# Altium schematic sheet 23.SchDoc
size 297 x 209 mm
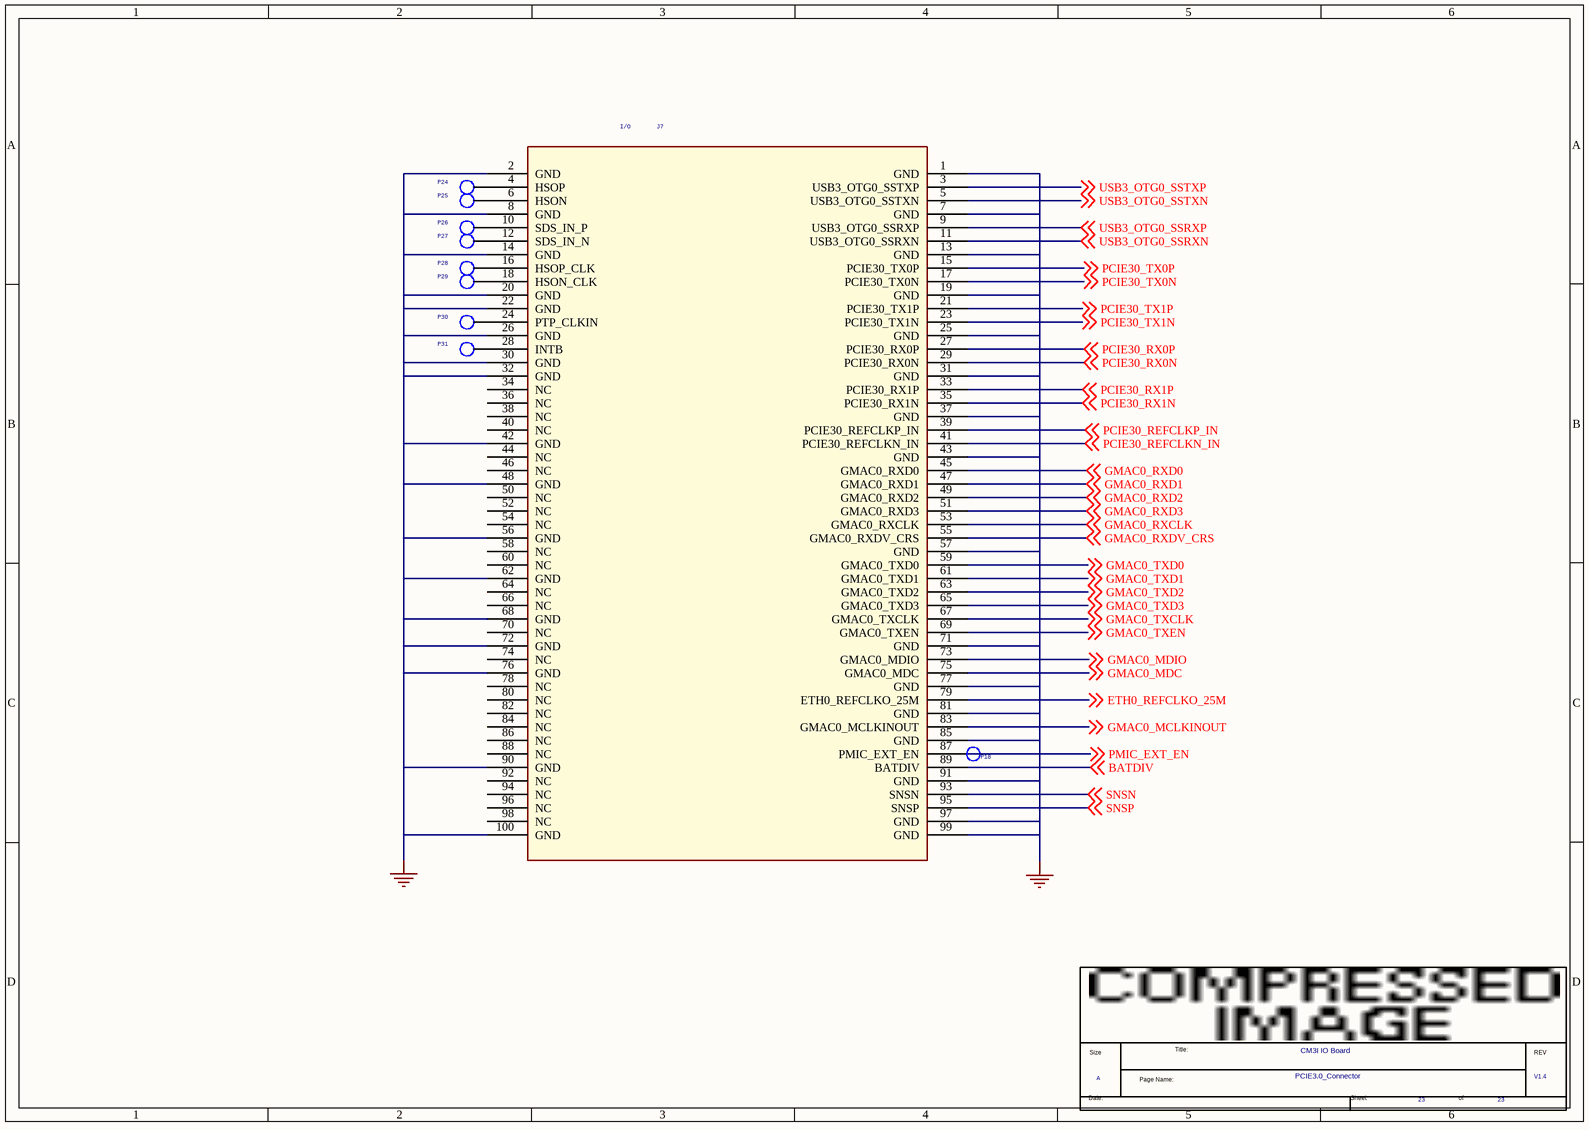
[diagram p0: 23.SchDoc]

## Parts
*  Page Count: 23  Page Size: A  Title: CM3I IO Board  RevCode: V1.4  Doc: PCIE3.0_Connector  (hidden comment: radxa_1010)  (graphical)
J7  I/O  [DF40C_100DS]
P18  TEST  [TEST]  (value not drawn)
P24  TEST  [TEST]  (value not drawn)
P25  TEST  [TEST]  (value not drawn)
P26  TEST  [TEST]  (value not drawn)
P27  TEST  [TEST]  (value not drawn)
P28  TEST  [TEST]  (value not drawn)
P29  TEST  [TEST]  (value not drawn)
P30  TEST  [TEST]  (value not drawn)
P31  TEST  [TEST]  (value not drawn)

## Nets
GND: J7.1(GND) J7.2(GND) J7.7(GND) J7.8(GND) J7.13(GND) J7.14(GND) J7.19(GND) J7.20(GND) J7.22(GND) J7.25(GND) J7.26(GND) J7.30(GND) J7.31(GND) J7.32(GND) J7.37(GND) J7.42(GND) J7.43(GND) J7.48(GND) J7.56(GND) J7.57(GND) J7.62(GND) J7.68(GND) J7.71(GND) J7.72(GND) J7.76(GND) J7.77(GND) J7.81(GND) J7.85(GND) J7.90(GND) J7.91(GND) J7.97(GND) J7.99(GND) J7.100(GND)
BATDIV: J7.89(BATDIV) ; off-sheet BATDIV
ETH0_REFCLKO_25M: J7.79(ETH0_REFCLKO_25M) ; off-sheet ETH0_REFCLKO_25M
GMAC0_MCLKINOUT: J7.83(GMAC0_MCLKINOUT) ; off-sheet GMAC0_MCLKINOUT
GMAC0_MDC: J7.75(GMAC0_MDC) ; off-sheet GMAC0_MDC
GMAC0_MDIO: J7.73(GMAC0_MDIO) ; off-sheet GMAC0_MDIO
GMAC0_RXCLK: J7.53(GMAC0_RXCLK) ; off-sheet GMAC0_RXCLK
GMAC0_RXD0: J7.45(GMAC0_RXD0) ; off-sheet GMAC0_RXD0
GMAC0_RXD1: J7.47(GMAC0_RXD1) ; off-sheet GMAC0_RXD1
GMAC0_RXD2: J7.49(GMAC0_RXD2) ; off-sheet GMAC0_RXD2
GMAC0_RXD3: J7.51(GMAC0_RXD3) ; off-sheet GMAC0_RXD3
GMAC0_RXDV_CRS: J7.55(GMAC0_RXDV_CRS) ; off-sheet GMAC0_RXDV_CRS
GMAC0_TXCLK: J7.67(GMAC0_TXCLK) ; off-sheet GMAC0_TXCLK
GMAC0_TXD0: J7.59(GMAC0_TXD0) ; off-sheet GMAC0_TXD0
GMAC0_TXD1: J7.61(GMAC0_TXD1) ; off-sheet GMAC0_TXD1
GMAC0_TXD2: J7.63(GMAC0_TXD2) ; off-sheet GMAC0_TXD2
GMAC0_TXD3: J7.65(GMAC0_TXD3) ; off-sheet GMAC0_TXD3
GMAC0_TXEN: J7.69(GMAC0_TXEN) ; off-sheet GMAC0_TXEN
PCIE30_REFCLKN_IN: J7.41(PCIE30_REFCLKN_IN) ; off-sheet PCIE30_REFCLKN_IN
PCIE30_REFCLKP_IN: J7.39(PCIE30_REFCLKP_IN) ; off-sheet PCIE30_REFCLKP_IN
PCIE30_RX0N: J7.29(PCIE30_RX0N) ; off-sheet PCIE30_RX0N
PCIE30_RX0P: J7.27(PCIE30_RX0P) ; off-sheet PCIE30_RX0P
PCIE30_RX1N: J7.35(PCIE30_RX1N) ; off-sheet PCIE30_RX1N
PCIE30_RX1P: J7.33(PCIE30_RX1P) ; off-sheet PCIE30_RX1P
PCIE30_TX0N: J7.17(PCIE30_TX0N) ; off-sheet PCIE30_TX0N
PCIE30_TX0P: J7.15(PCIE30_TX0P) ; off-sheet PCIE30_TX0P
PCIE30_TX1N: J7.23(PCIE30_TX1N) ; off-sheet PCIE30_TX1N
PCIE30_TX1P: J7.21(PCIE30_TX1P) ; off-sheet PCIE30_TX1P
PMIC_EXT_EN: J7.87(PMIC_EXT_EN) P18.1 ; off-sheet PMIC_EXT_EN
SNSN: J7.93(SNSN) ; off-sheet SNSN
SNSP: J7.95(SNSP) ; off-sheet SNSP
USB3_OTG0_SSRXN: J7.11(USB3_OTG0_SSRXN) ; off-sheet USB3_OTG0_SSRXN
USB3_OTG0_SSRXP: J7.9(USB3_OTG0_SSRXP) ; off-sheet USB3_OTG0_SSRXP
USB3_OTG0_SSTXN: J7.5(USB3_OTG0_SSTXN) ; off-sheet USB3_OTG0_SSTXN
USB3_OTG0_SSTXP: J7.3(USB3_OTG0_SSTXP) ; off-sheet USB3_OTG0_SSTXP
NetJ7_4: J7.4(HSOP) P24.1
NetJ7_6: J7.6(HSON) P25.1
NetJ7_10: J7.10(SDS_IN_P) P26.1
NetJ7_12: J7.12(SDS_IN_N) P27.1
NetJ7_16: J7.16(HSOP_CLK) P28.1
NetJ7_18: J7.18(HSON_CLK) P29.1
NetJ7_24: J7.24(PTP_CLKIN) P30.1
NetJ7_28: J7.28(INTB) P31.1

Not connected (* = marked no-connect by the designer): J7 34(NC) 36(NC) 38(NC) 40(NC) 44(NC) 46(NC) 50(NC) 52(NC) 54(NC) 58(NC) 60(NC) 64(NC) 66(NC) 70(NC) 74(NC) 78(NC) 80(NC) 82(NC) 84(NC) 86(NC) 88(NC) 92(NC) 94(NC) 96(NC) 98(NC)

## Notes on the sheet
- (in symbol radxa_1010) Title:; Size; REV; Page Name:; Date:; Sheet; of

## Library data of the parts
J7 = CN_10
P18 P24-P31 = TESTPOINT1
* = radxa_1010: Page Number: 23; Page Create Date: March  8, 1995